# Altium schematic sheet GPIO_schem.SchDoc
size A
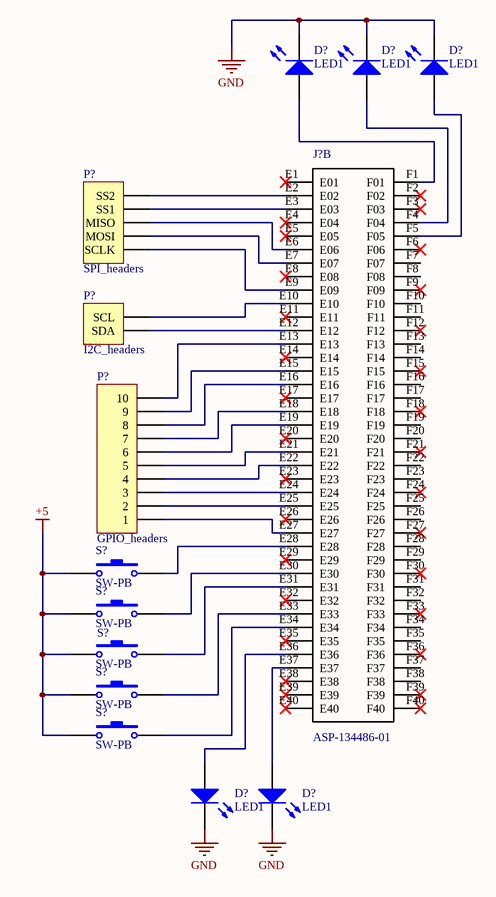
[diagram p0: GPIO_schem.SchDoc]

## Parts
(Parts that share a designator on the sheet are numbered #1, #2 ... from top to bottom, then left to right.)
D?#1  LED1  [LED-1]
D?#2  LED1  [LED-1]
D?#3  LED1  [LED-1]
D?#4  LED1  [LED-1]
D?#5  LED1  [LED-1]
J?  ASP-134486-01  [*SAMTEC_ASP-134486-01_ASP-134486-01(Primary)]  (part B of 5)
P?#1  SPI_headers  [HDR1X5]
P?#2  I2C_headers  [HDR1X2]
P?#3  GPIO_headers  [HDR1X10]
S?#1  SW-PB  [SPST-2]
S?#2  SW-PB  [SPST-2]
S?#3  SW-PB  [SPST-2]
S?#4  SW-PB  [SPST-2]
S?#5  SW-PB  [SPST-2]

## Nets
+5: S?#1.1 S?#2.1 S?#3.1 S?#4.1 S?#5.1
GND: D?#1.2(K) D?#2.2(K) D?#3.2(K) D?#4.2(K) D?#5.2(K)
NetD?#1_1: D?#1.1(A) J?.F1(F01)
NetD?#2_1: D?#2.1(A) J?.F4(F04)
NetD?#3_1: D?#3.1(A) J?.F5(F05)
NetD?#4_1: D?#4.1(A) J?.E36
NetD?#5_1: D?#5.1(A) J?.E37
NetJ?_E2: J?.E2(E02) P?#1.5(SS2)
NetJ?_E3: J?.E3(E03) P?#1.4(SS1)
NetJ?_E6: J?.E6(E06) P?#1.3(MISO)
NetJ?_E7: J?.E7(E07) P?#1.2(MOSI)
NetJ?_E9: J?.E9(E09) P?#1.1(SCLK)
NetJ?_E10: J?.E10 P?#2.2(SCL)
NetJ?_E12: J?.E12 P?#2.1(SDA)
NetJ?_E13: J?.E13 P?#3.10
NetJ?_E15: J?.E15 P?#3.9
NetJ?_E16: J?.E16 P?#3.8
NetJ?_E18: J?.E18 P?#3.7
NetJ?_E19: J?.E19 P?#3.6
NetJ?_E21: J?.E21 P?#3.5
NetJ?_E22: J?.E22 P?#3.4
NetJ?_E24: J?.E24 P?#3.3
NetJ?_E25: J?.E25 P?#3.2
NetJ?_E27: J?.E27 P?#3.1
NetJ?_E28: J?.E28 S?#1.2
NetJ?_E30: J?.E30 S?#2.2
NetJ?_E31: J?.E31 S?#3.2
NetJ?_E33: J?.E33 S?#4.2
NetJ?_E34: J?.E34 S?#5.2

Not connected (* = marked no-connect by the designer): J? E1(E01)* E4(E04)* E5(E05)* E8(E08)* E11* E14* E17* E20* E23* E26* E29* E32* E35* E38* E39* E40* F2(F02)* F3(F03)* F6(F06)* F7(F07) F8(F08) F9(F09)* F10 F11 F12* F13 F14 F15* F16 F17 F18* F19 F20 F21* F22 F23 F24* F25 F26 F27* F28 F29 F30* F31 F32 F33* F34 F35 F36* F37 F38 F39* F40*

## Library data of the parts
D?#1-D?#5 = LED1: Typical RED GaAs LED; Published: 8-Jun-2000; LatestRevisionDate: 08-Jul-2005; LatestRevisionNote: Mech Layer 1 removed.; PackageReference: LED-1; Publisher: Altium Limited; PackageDescription: LED; 2 Leads
J? = ASP-134486-01: 400 Position Connector Array, Female Sockets Surface Mount Gold; MF: Samtec Inc.; MP: ASP-134486-01; Digi-Key_Purchase_URL: https://www.digikey.com/product-detail/en/samtec-inc/ASP-134486-01/SAM8728CT-ND/2135095?utm_source=snapeda&utm_medium=aggregator&utm_campaign=symbol; SnapEDA_Link: https://www.snapeda.com/parts/ASP-134486-01/Samtec%20Inc./view-part/898249/?ref=snap; Package: None; Digi-Key_Part_Number: SAM8728CT-ND; Value: *
P?#1 = Header 5: Header, 5-Pin; LatestRevisionDate: 17-Jul-2002; LatestRevisionNote: Re-released for DXP Platform.; Publisher: Altium Limited
P?#2 = Header 2: Header, 2-Pin; LatestRevisionDate: 17-Jul-2002; LatestRevisionNote: Re-released for DXP Platform.; Publisher: Altium Limited
P?#3 = Header 10: Header, 10-Pin; LatestRevisionDate: 17-Jul-2002; LatestRevisionNote: Re-released for DXP Platform.; Publisher: Altium Limited
S?#1-S?#5 = SW-PB: Switch; Published: 24-Mar-1999; LatestRevisionDate: 17-Jul-2002; LatestRevisionNote: Re-released for DXP Platform.; PackageReference: SPST-2; Publisher: Altium Limited; PackageDescription: Switch; 2 Leads